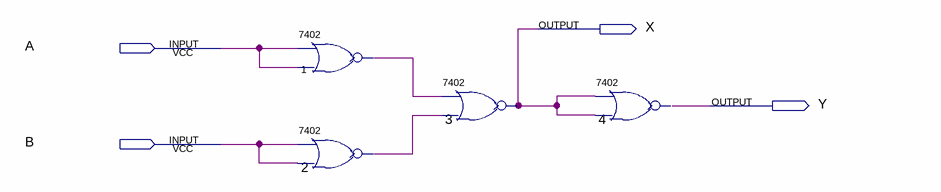
[diagram p0: schematic sheet]
// Quartus schematic Project.bdf as structural Verilog: 4 symbols, 4 pins
module Project (
  input  A,
  input  B,
  output X,
  output Y
);

  wire n1_1, n2_1;

  \7402  u_1 (.\2 (A), .\3 (A), .\1 (n1_1));
  \7402  u_2 (.\2 (B), .\3 (B), .\1 (n2_1));
  \7402  u_3 (.\2 (n1_1), .\3 (n2_1), .\1 (X));
  \7402  u_4 (.\2 (X), .\3 (X), .\1 (Y));
endmodule
